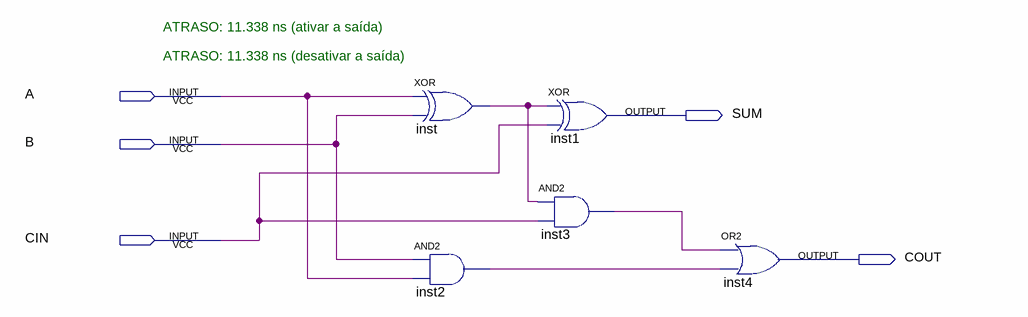
[diagram p0: schematic sheet]
// Quartus schematic full_adder_1bit.bdf as structural Verilog: 5 symbols, 5 pins
module full_adder_1bit (
  input  A,
  input  B,
  input  CIN,
  output SUM,
  output COUT
);

  wire inst2_out, inst3_out, inst_out;

  xor inst (inst_out, A, B);
  and inst2 (inst2_out, B, A);
  xor inst1 (SUM, inst_out, CIN);
  and inst3 (inst3_out, inst_out, CIN);
  or inst4 (COUT, inst3_out, inst2_out);

  // Notes on the sheet:
  //   ATRASO: 11.338 ns (ativar a saída)
  //   ATRASO: 11.338 ns (desativar a saída)
endmodule
